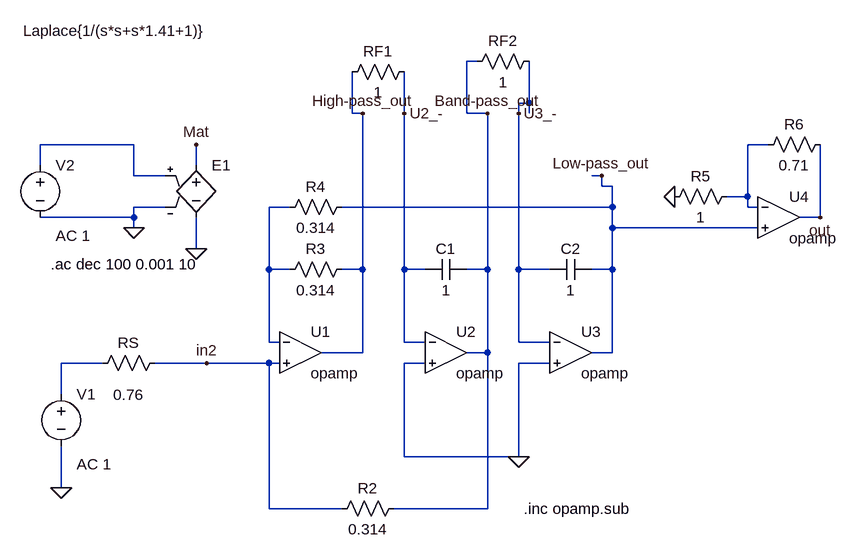
[diagram p0: schematic demo.asc]
demo.asc, the LTspice schematic file:
Version 4
SHEET 1 1836 1000
WIRE 896 -176 880 -176
WIRE 976 -112 976 -176
WIRE 976 -112 960 -112
WIRE 704 -96 704 -160
WIRE 720 -96 704 -96
WIRE 784 -96 784 -160
WIRE 880 -96 880 -176
WIRE 912 -96 880 -96
WIRE 960 -96 960 -112
WIRE 976 -96 976 -112
WIRE 368 -48 224 -48
WIRE 1344 -48 1312 -48
WIRE 224 -16 224 -48
WIRE 464 -16 464 -48
WIRE 368 0 368 -48
WIRE 416 0 368 0
WIRE 1088 0 1072 0
WIRE 1088 16 1088 0
WIRE 1104 16 1088 16
WIRE 1312 32 1312 -48
WIRE 1312 32 1280 32
WIRE 416 48 368 48
WIRE 608 48 576 48
WIRE 1104 48 1104 16
WIRE 1104 48 688 48
WIRE 1312 48 1312 32
WIRE 1328 48 1312 48
WIRE 368 64 368 48
WIRE 368 64 224 64
WIRE 1424 64 1424 -48
WIRE 1424 64 1392 64
WIRE 368 80 368 64
WIRE 1104 80 1104 48
WIRE 1328 80 1104 80
WIRE 464 112 464 64
WIRE 576 144 576 48
WIRE 608 144 576 144
WIRE 720 144 720 -96
WIRE 720 144 688 144
WIRE 784 144 784 -96
WIRE 816 144 784 144
WIRE 912 144 912 -96
WIRE 912 144 880 144
WIRE 960 144 960 -96
WIRE 1008 144 960 144
WIRE 1104 144 1104 80
WIRE 1104 144 1072 144
WIRE 576 256 576 144
WIRE 592 256 576 256
WIRE 784 256 784 144
WIRE 816 256 784 256
WIRE 960 256 960 144
WIRE 1008 256 960 256
WIRE 720 272 720 144
WIRE 720 272 656 272
WIRE 912 272 912 144
WIRE 912 272 880 272
WIRE 1104 272 1104 144
WIRE 1104 272 1072 272
WIRE 320 288 256 288
WIRE 480 288 400 288
WIRE 576 288 480 288
WIRE 592 288 576 288
WIRE 816 288 784 288
WIRE 1008 288 960 288
WIRE 256 336 256 288
WIRE 784 432 784 288
WIRE 960 432 960 288
WIRE 960 432 784 432
WIRE 256 480 256 416
WIRE 576 512 576 288
WIRE 688 512 576 512
WIRE 912 512 912 272
WIRE 912 512 768 512
FLAG 480 288 in2
FLAG 960 432 0
FLAG 1088 0 Low-pass_out
FLAG 912 -96 Band-pass_out
FLAG 720 -96 High-pass_out
FLAG 784 -96 U2_-
FLAG 960 -96 U3_-
FLAG 256 480 0
FLAG 368 80 0
FLAG 464 -48 Mat
FLAG 464 112 0
FLAG 1200 32 0
FLAG 1424 64 out
SYMBOL voltage 256 320 R0
WINDOW 123 24 124 Left 2
WINDOW 39 0 0 Left 2
SYMATTR Value2 AC 1
SYMATTR InstName V1
SYMATTR Value ""
SYMBOL res 304 304 R270
WINDOW 0 32 56 VTop 2
WINDOW 3 -17 56 VBottom 2
SYMATTR InstName RS
SYMATTR Value 0.76
SYMBOL res 672 528 R270
WINDOW 0 32 56 VTop 2
WINDOW 3 0 56 VBottom 2
SYMATTR InstName R2
SYMATTR Value 0.314
SYMBOL res 592 160 R270
WINDOW 0 32 56 VTop 2
WINDOW 3 0 56 VBottom 2
SYMATTR InstName R3
SYMATTR Value 0.314
SYMBOL res 592 64 R270
WINDOW 0 32 56 VTop 2
WINDOW 3 0 56 VBottom 2
SYMATTR InstName R4
SYMATTR Value 0.314
SYMBOL cap 816 160 R270
WINDOW 0 32 32 VTop 2
WINDOW 3 0 32 VBottom 2
SYMATTR InstName C1
SYMATTR Value 1
SYMBOL cap 1008 160 R270
WINDOW 0 32 32 VTop 2
WINDOW 3 0 32 VBottom 2
SYMATTR InstName C2
SYMATTR Value 1
SYMBOL res 688 -144 R270
WINDOW 0 32 56 VTop 2
WINDOW 3 0 56 VBottom 2
SYMATTR InstName RF1
SYMATTR Value 1
SYMBOL res 880 -160 R270
WINDOW 0 32 56 VTop 2
WINDOW 3 0 56 VBottom 2
SYMATTR InstName RF2
SYMATTR Value 1
SYMBOL OpAmps\\opamp 624 208 R0
SYMATTR InstName U1
SYMATTR SpiceLine2 GBW=10000000Meg
SYMBOL OpAmps\\opamp 848 208 R0
SYMATTR InstName U2
SYMATTR SpiceLine2 GBW=10000000Meg
SYMBOL OpAmps\\opamp 1040 208 R0
SYMATTR InstName U3
SYMATTR SpiceLine2 GBW=10000000Meg
SYMBOL voltage 224 -32 R0
WINDOW 123 24 124 Left 2
WINDOW 39 0 0 Left 0
SYMATTR Value2 AC 1
SYMATTR InstName V2
SYMATTR Value ""
SYMBOL e 464 -32 R0
WINDOW 3 -266 -191 Left 2
SYMATTR Value Laplace{1/(s*s+s*1.41+1)}
SYMATTR InstName E1
SYMBOL OpAmps\\opamp 1360 0 R0
SYMATTR InstName U4
SYMATTR SpiceLine2 GBW=10000000Meg
SYMBOL res 1296 16 R90
WINDOW 0 0 56 VBottom 2
WINDOW 3 32 56 VTop 2
SYMATTR InstName R5
SYMATTR Value 1
SYMBOL res 1440 -64 R90
WINDOW 0 0 56 VBottom 2
WINDOW 3 32 56 VTop 2
SYMATTR InstName R6
SYMATTR Value 0.71
TEXT 968 512 Left 2 !.inc opamp.sub
TEXT 240 136 Left 2 !.ac dec 100 0.001 10

The netlist it stands for:
* demo.asc
V1 N004 0 AC 1
RS N004 in2 0.76
R2 in2 Band-pass_out 0.314
R3 N003 High-pass_out 0.314
R4 N003 Low-pass_out 0.314
C1 U2_- Band-pass_out 1
C2 U3_- Low-pass_out 1
RF1 High-pass_out U2_- 1
RF2 Band-pass_out U3_- 1
XU1 N003 in2 High-pass_out opamp Aol=100K GBW=10000000Meg  ; pins invin noninvin out
XU2 U2_- 0 Band-pass_out opamp Aol=100K GBW=10000000Meg  ; pins invin noninvin out
XU3 U3_- 0 Low-pass_out opamp Aol=100K GBW=10000000Meg  ; pins invin noninvin out
V2 N001 0 AC 1
E1 Mat 0 N001 0 Laplace{1/(s*s+s*1.41+1)}
XU4 N002 Low-pass_out out opamp Aol=100K GBW=10000000Meg  ; pins invin noninvin out
R5 N002 0 1
R6 out N002 0.71
.inc opamp.sub
.ac dec 100 0.001 10
.backanno
.end

* Results of the author's LTspice run, read from the files saved beside the schematic
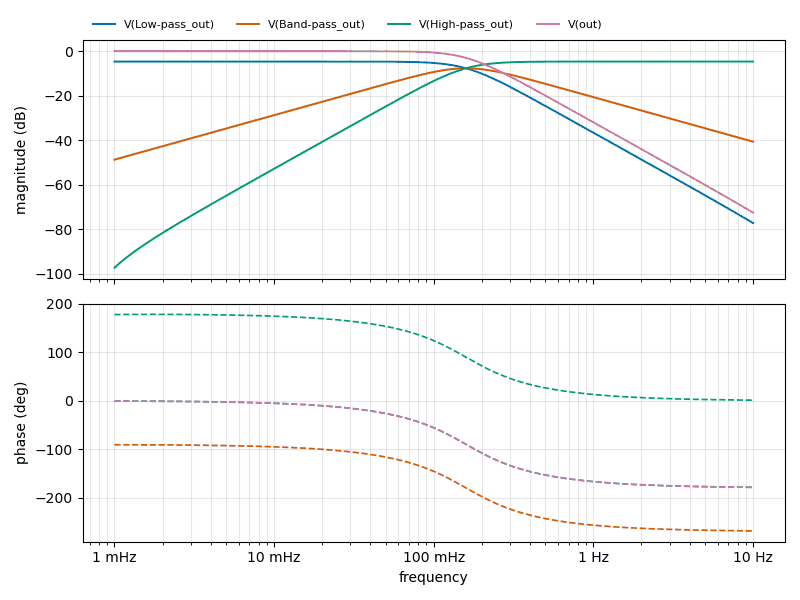
[diagram p1: AC Analysis of demo.asc, plotted from the saved traces]
* AC Analysis, 1 run:
*   V(Low-pass_out): -4.66 dB at 1 mHz, -77.15 dB at 10 Hz, peak -4.66 dB at 1 mHz, 3 dB below the peak at 159 mHz
*   V(Band-pass_out): -48.70 dB at 1 mHz, -40.63 dB at 10 Hz, peak -7.68 dB at 158.5 mHz, 3 dB below the peak at 82.34 mHz and 307.6 mHz
*   V(High-pass_out): -97.22 dB at 1 mHz, -4.66 dB at 10 Hz, peak -4.66 dB at 10 Hz, 3 dB below the peak at 159.3 mHz
*   V(out): -0.00 dB at 1 mHz, -72.49 dB at 10 Hz, peak -0.00 dB at 1 mHz, 3 dB below the peak at 159 mHz